# EAGLE design fabflash-mk-2.3-driver (EAGLE 6.5.0)
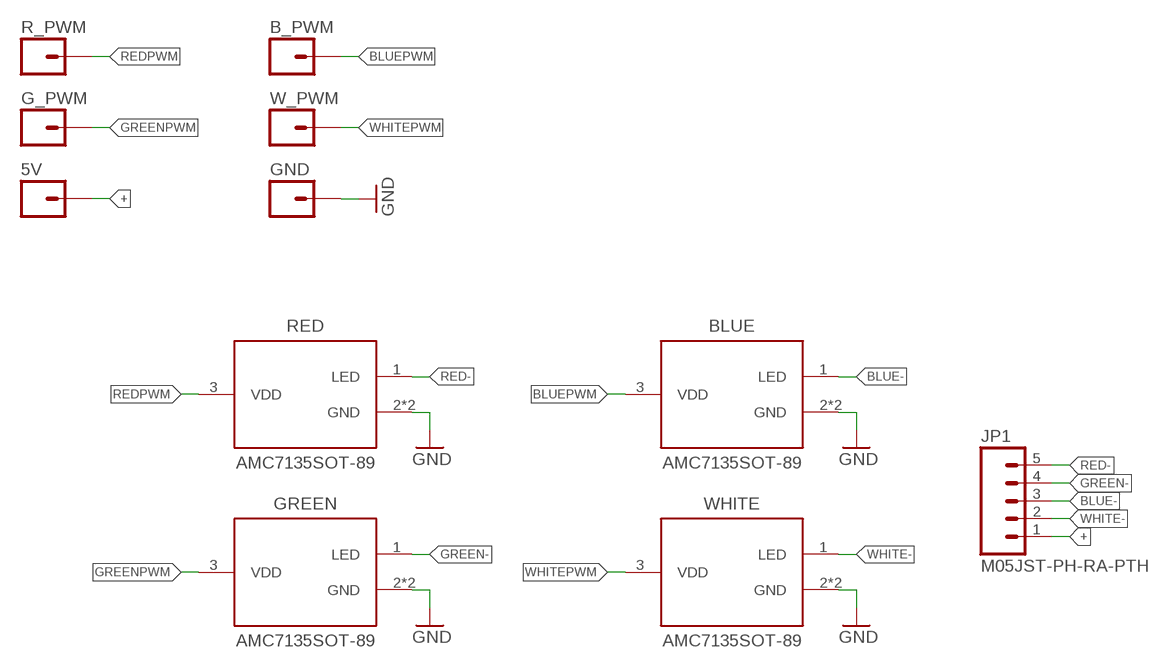
[diagram p0: schematic, sheet 1]

## Parts
5V  M01PTH-0.9MM  [1X01-0.9MM]
B_PWM  M01PTH-0.9MM  [1X01-0.9MM]
BLUE  AMC7135SOT-89  [SOT89]
G_PWM  M01PTH-0.9MM  [1X01-0.9MM]
GND  M01PTH-0.9MM  [1X01-0.9MM]
GREEN  AMC7135SOT-89  [SOT89]
JP1  M05JST-PH-RA-PTH  [JST-5-PH-RA-PTH]
R_PWM  M01PTH-0.9MM  [1X01-0.9MM]
RED  AMC7135SOT-89  [SOT89]
W_PWM  M01PTH-0.9MM  [1X01-0.9MM]
WHITE  AMC7135SOT-89  [SOT89]

## Nets
+: 5V.1 JP1.1
BLUE-: BLUE.1(LED) JP1.3
BLUEPWM: B_PWM.1 BLUE.3(VDD)
GND: BLUE.2(GND) BLUE.4(GND) GND.1 GREEN.2(GND) GREEN.4(GND) RED.2(GND) RED.4(GND) WHITE.2(GND) WHITE.4(GND)
GREEN-: GREEN.1(LED) JP1.4
GREENPWM: G_PWM.1 GREEN.3(VDD)
RED-: JP1.5 RED.1(LED)
REDPWM: R_PWM.1 RED.3(VDD)
WHITE-: JP1.2 WHITE.1(LED)
WHITEPWM: W_PWM.1 WHITE.3(VDD)

## Library data of the parts
5V B_PWM G_PWM GND R_PWM W_PWM = A_butts:M01: Header 1 Standard 1-pin 0.1" header. Use with straight break away headers (SKU : PRT-00116), right angle break away headers (PRT-00553), swiss pins (PRT-00743), machine pins (PRT-00117), and female headers (PRT-00115).
BLUE GREEN RED WHITE = A_butts:AMC7135
JP1 = A_butts:M05: Header 5 Standard 5-pin 0.1" header. Use with straight break away headers (SKU : PRT-00116), right angle break away headers (PRT-00553), swiss pins (PRT-00743), machine pins (PRT-00117), and female headers (PRT-00115). Molex polarized connector foot print use with SKU : PRT-08230 with associated crimp pins and housings.

## Board
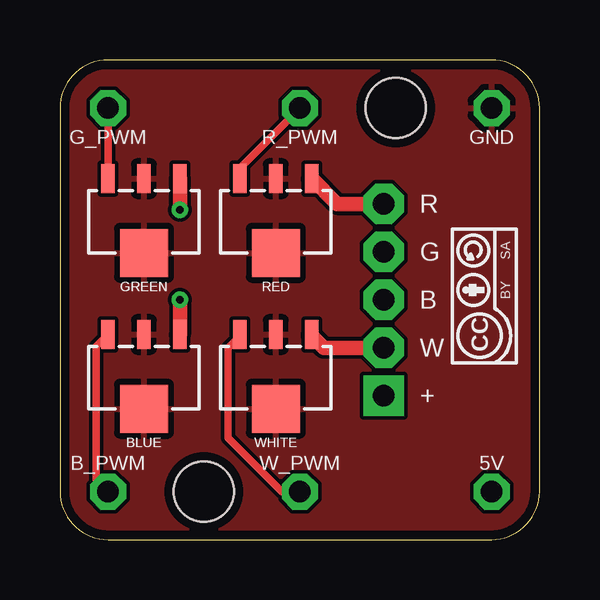
[diagram p1: board, top side]
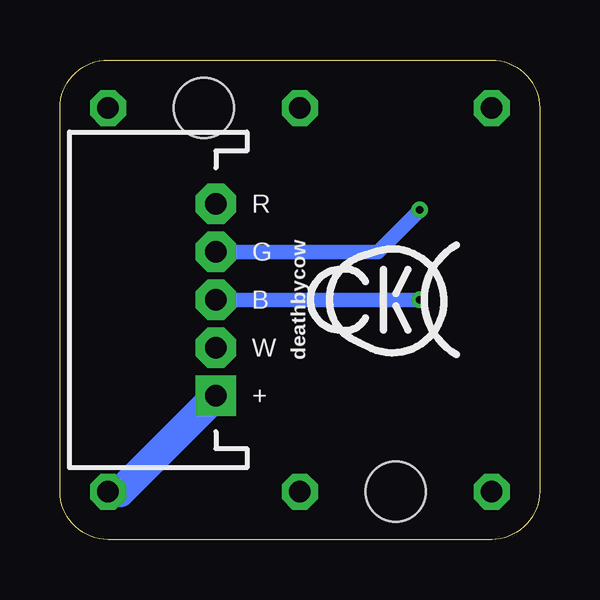
[diagram p2: board, bottom side, seen from below]

Size 20 x 20 mm. Coordinates in mm from the lower left corner, seen from the top.
Outline: 0,18 0,2 arc90 2,0 18,0 arc90 20,2 20,18 arc90 18,20 2,20 arc90 0,18
Copper layers (1*16): Top 0.0356mm / dielectric 1.5011mm / Bottom 0.0356mm
Design rules "LaenPCBOrder2": minimum track width 6mil, minimum drill 13mil, track to track 6mil, track to pad 6mil, pad to pad 6mil, via to via 6mil, smd to smd 6mil, copper to edge 15mil, drill to drill 6mil, minimum pad ring 7mil, minimum via ring 7mil, stop-mask expansion 3mil, vias tented up to drill 20mil, thermal gap 10mil
Holes 2.5 mm at 6,2 14,18

### Footprints (pad centres in the part's own frame; a part is rotated, then mirrored left to right if it is on the bottom)
1X01-0.9MM = drill 0.9 pad 1.5 octagon: 1 0,0
SOT89 = smd 0.58 x 1.2: 1 -1.5,-1.8; 2 0,-1.8; 3 1.5,-1.8 | smd 2 x 2: 4 0,1.3
JST-5-PH-RA-PTH = drill 0.9 pad 1.676 square: 1 -4,0 | drill 0.9 pad 1.676 octagon: 2 -2,0; 3 0,0; 4 2,0; 5 4,0

### Placement (x,y rotation side)
5V  18,2 0 top
B_PWM  2,2 0 top
BLUE  3.5,6.75 180 top
G_PWM  2,18 180 top
GND  18,18 180 top
GREEN  3.5,13.25 180 top
JP1  13.5,10 90 bottom
R_PWM  10,18 180 top
RED  9,13.25 180 top
U$1  [CC-BY-SA-4.0-NO-URL]  17.5,8.5 90 top
U$2  [COW_SMALL]  6,10 270 bottom
W_PWM  10,2 0 top
WHITE  9,6.75 180 top

### Tracks (layer width: path | path; a pad name or v marks a point on that pad's centre or on a via)
+
  Bottom 1.27: 5V.1 17.5,2 JP1.1
BLUE-  (via drill 0.33)
  Top 0.61: v5,10 BLUE.1
  Bottom 0.61: v5,10 JP1.3
BLUEPWM
  Top 0.305: B_PWM.1 1.5,2.5 1.5,8.05 BLUE.3
GND
  pour Top: 2,20 18,20 arc-90 20,18 20,2 arc-90 18,0 2,0 arc-90 0,2 0,18 arc-90
GREEN-  (via drill 0.33)
  Top 0.61: v5,13.75 GREEN.1
  Bottom 0.61: v5,13.75 6.75,12 JP1.4
GREENPWM
  Top 0.305: G_PWM.1 GREEN.3
RED-
  Top 0.61: RED.1 11.55,14 JP1.5
REDPWM
  Top 0.305: RED.3 7.5,15.5 R_PWM.1
WHITE-
  Top 0.61: JP1.2 11,8 10.5,8.5 WHITE.1
WHITEPWM
  Top 0.305: WHITE.3 7.5,8.5 7,8 7,4.25 9.25,2 W_PWM.1

### Text on the board
tNames: R | G | B | W | +
bNames: R | G | B | W | +